# EAGLE design PFC_drivers_v1 (EAGLE 7.6.0)
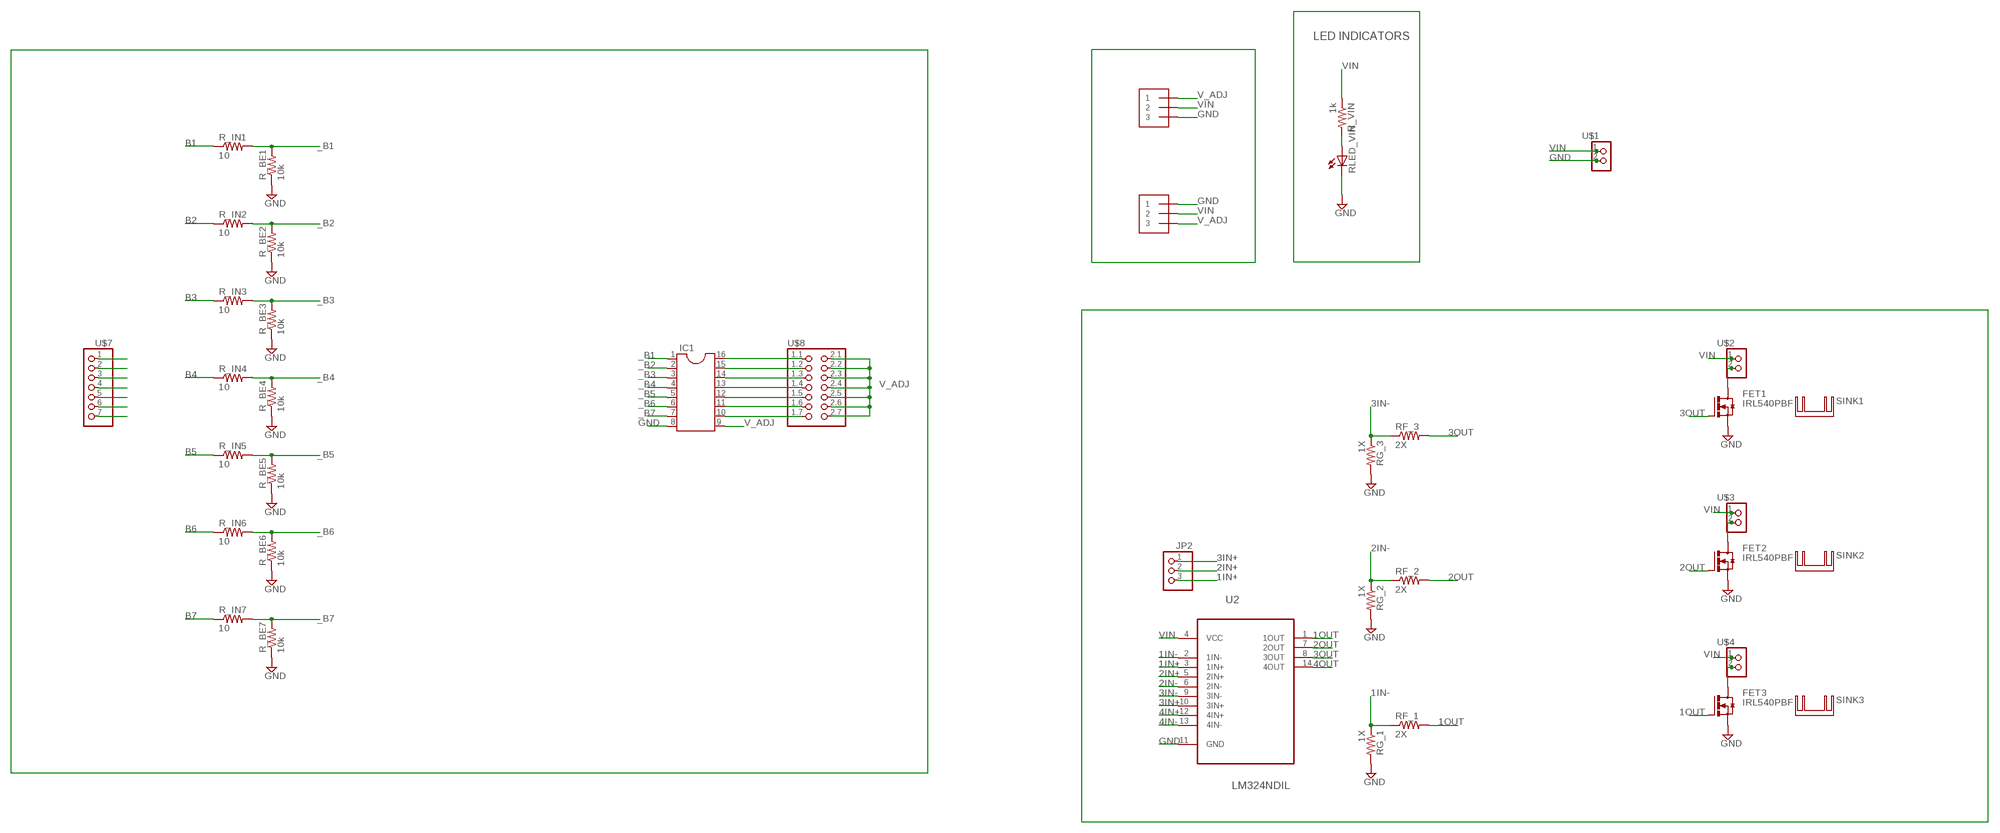
[diagram p0: schematic, sheet 1]

## Parts
FET1  IRL540PBF  [TO220AV]
FET2  IRL540PBF  [TO220AV]
FET3  IRL540PBF  [TO220AV]
IC1  DIL16S  [SOCKET-16]
JP2  PINHD-1X3  [1X03]
R_BE1  10k  R-US_R0603  [R0603]
R_BE2  10k  R-US_R0603  [R0603]
R_BE3  10k  R-US_R0603  [R0603]
R_BE4  10k  R-US_R0603  [R0603]
R_BE5  10k  R-US_R0603  [R0603]
R_BE6  10k  R-US_R0603  [R0603]
R_BE7  10k  R-US_R0603  [R0603]
R_IN1  10  R-US_R0603  [R0603]
R_IN2  10  R-US_R0603  [R0603]
R_IN3  10  R-US_R0603  [R0603]
R_IN4  10  R-US_R0603  [R0603]
R_IN5  10  R-US_R0603  [R0603]
R_IN6  10  R-US_R0603  [R0603]
R_IN7  10  R-US_R0603  [R0603]
R_VIN  1k  R-US_R0603  [R0603]
RF_1  2X  R-US_R0603  [R0603]
RF_2  2X  R-US_R0603  [R0603]
RF_3  2X  R-US_R0603  [R0603]
RG_1  1X  R-US_R0603  [R0603]
RG_2  1X  R-US_R0603  [R0603]
RG_3  1X  R-US_R0603  [R0603]
RLED_VIN  LEDCHIP-LED0603  [CHIP-LED0603]
SINK1  FW1S  [FW1S]
SINK2  FW1S  [FW1S]
SINK3  FW1S  [FW1S]
U2  LM324NDIL  [DIL14]
U$1  PINHD-2X1  [2X01]
U$2  PINHD-2X1  [2X01]
U$3  PINHD-2X1  [2X01]
U$4  PINHD-2X1  [2X01]
U$5  1X3  [1X3-3.5MM]
U$6  1X3  [1X3-3.5MM]
U$7  PINHD-1X7  [1X07]
U$8  PINHD-2X7  [2X07-BIG]

## Nets
1IN+: JP2.3 U2.3(1IN+)
1IN-: RF_1.1 RG_1.1 U2.2(1IN-)
1OUT: FET3.B(G) RF_1.2 U2.1(1OUT)
2IN+: JP2.2 U2.5(2IN+)
2IN-: RF_2.1 RG_2.1 U2.6(2IN-)
2OUT: FET2.B(G) RF_2.2 U2.7(2OUT)
3IN+: JP2.1 U2.10(3IN+)
3IN-: RF_3.1 RG_3.1 U2.9(3IN-)
3OUT: FET1.B(G) RF_3.2 U2.8(3OUT)
4IN+: U2.12(4IN+)
4IN-: U2.13(4IN-)
4OUT: U2.14(4OUT)
_B1: IC1.1 R_BE1.2 R_IN1.2
_B2: IC1.2 R_BE2.2 R_IN2.2
_B3: IC1.3 R_BE3.2 R_IN3.2
_B4: IC1.4 R_BE4.2 R_IN4.2
_B5: IC1.5 R_BE5.2 R_IN5.2
_B6: IC1.6 R_BE6.2 R_IN6.2
_B7: IC1.7 R_BE7.2 R_IN7.2
B1: R_IN1.1 U$7.1
B2: R_IN2.1 U$7.2
B3: R_IN3.1 U$7.3
B4: R_IN4.1 U$7.4
B5: R_IN5.1 U$7.5
B6: R_IN6.1 U$7.6
B7: R_IN7.1 U$7.7
GND: FET1.E(S) FET2.E(S) FET3.E(S) IC1.8 R_BE1.1 R_BE2.1 R_BE3.1 R_BE4.1 R_BE5.1 R_BE6.1 R_BE7.1 RG_1.2 RG_2.2 RG_3.2 RLED_VIN.C U2.11(GND) U$1.2 U$5.3 U$6.1
N$1: R_VIN.2 RLED_VIN.A
N$4: IC1.10 U$8.1.7
N$5: IC1.11 U$8.1.6
N$7: IC1.12 U$8.1.5
N$8: IC1.13 U$8.1.4
N$9: IC1.14 U$8.1.3
N$10: IC1.15 U$8.1.2
N$11: IC1.16 U$8.1.1
N$15: FET1.C(D) U$2.2
N$16: FET2.C(D) U$3.2
N$17: FET3.C(D) U$4.2
V_ADJ: IC1.9 U$5.1 U$6.3 U$8.2.1 U$8.2.2 U$8.2.3 U$8.2.4 U$8.2.5 U$8.2.6 U$8.2.7
VIN: R_VIN.1 U2.4(VCC) U$1.1 U$2.1 U$3.1 U$4.1 U$5.2 U$6.2

## Notes on the sheet
- LED INDICATORS

## Library data of the parts
FET1-FET3 = transistor-power:IRL540PBF
IC1 = ic-package:DIL16: Dual In Line / Socket
JP2 = adafruit:PINHD-1X3: PIN HEADER
R_BE1-R_BE7 R_IN1-R_IN7 R_VIN RF_1-RF_3 RG_1-RG_3 = resistor:R-US_: RESISTOR, American symbol
RLED_VIN = led:LED: LED OSRAM: - CHIPLED LG R971, LG N971, LY N971, LG Q971, LY Q971, LO R971, LY R971 LH N974, LH R974 LS Q976, LO Q976, LY Q976 LO Q996 - Hyper CHIPLED LW Q18S LB Q993, LB Q99A, LB R99A - SideLED LS A670, LO A670, LY A670, LG A670, LP A670 LB A673, LV A673, LT A673, LW A673 LH A674 LY A675 LS A676, LA A676, LO A676, LY A676, LW A676 LS A679, LY A679, LG A679 - Hyper Micro SIDELED® LS Y876, LA Y876, LO Y876, LY Y876 LT Y87S - SmartLED LW L88C, LW L88S LB L89C, LB L89S, LG L890 LS L89K, LO L89K, LY L89K LS L896, LA L896, LO L896, LY L896 - TOPLED LS T670, LO T670, LY T670, LG T670, LP T670 LSG T670, LSP T670, LSY T670, LOP T670, LYG T670 LG T671, LOG T671, LSG T671 LB T673, LV T673, LT T673, LW T673 LH T674 LS T676, LA T676, LO T676, LY T676, LB T676, LH T676, LSB T676, LW T676 LB T67C, LV T67C, LT T67C, LS T67K, LO T67K, LY T67K, LW E67C LS E67B, LA E67B, LO E67B, LY E67B, LB E67C, LV E67C, LT E67C LW T67C LS T679, LY T679, LG T679 LS T770, LO T770, LY T770, LG T770, LP T770 LB T773, LV T773, LT T773, LW T773 LH T774 LS E675, LA E675, LY E675, LS T675 LS T776, LA T776, LO T776, LY T776, LB T776 LHGB T686 LT T68C, LB T68C - Hyper Mini TOPLED® LB M676 - Mini TOPLED Santana® LG M470 LS M47K, LO M47K, LY M47K Source: http://www.osram.convergy.de LUXEON: - LUMILED® LXK2-PW12-R00, LXK2-PW12-S00, LXK2-PW14-U00, LXK2-PW14-V00 LXK2-PM12-R00, LXK2-PM12-S00, LXK2-PM14-U00 LXK2-PE12-Q00, LXK2-PE12-R00, LXK2-PE12-S00, LXK2-PE14-T00, LXK2-PE14-U00 LXK2-PB12-K00, LXK2-PB12-L00, LXK2-PB12-M00, LXK2-PB14-N00, LXK2-PB14-P00, LXK2-PB14-Q00 LXK2-PR12-L00, LXK2-PR12-M00, LXK2-PR14-Q00, LXK2-PR14-R00 LXK2-PD12-Q00, LXK2-PD12-R00, LXK2-PD12-S00 LXK2-PH12-R00, LXK2-PH12-S00 LXK2-PL12-P00, LXK2-PL12-Q00, LXK2-PL12-R00 Source: www.luxeon.com KINGBRIGHT: KA-3528ASYC Source: www.kingbright.com
SINK1-SINK3 = heatsink:FW1S
U2 = Texas Instruments_By_element14_Batch_1:LM324N: QUADRUPLE OPERATIONAL AMPLIFIERS
U$1-U$4 = pinhead:PINHD-2X1
U$5 U$6 = adafruit:1X3: 3.5mm Terminal Block
U$7 = adafruit:PINHD-1X7
U$8 = adafruit:PINHD-2X7

## Board
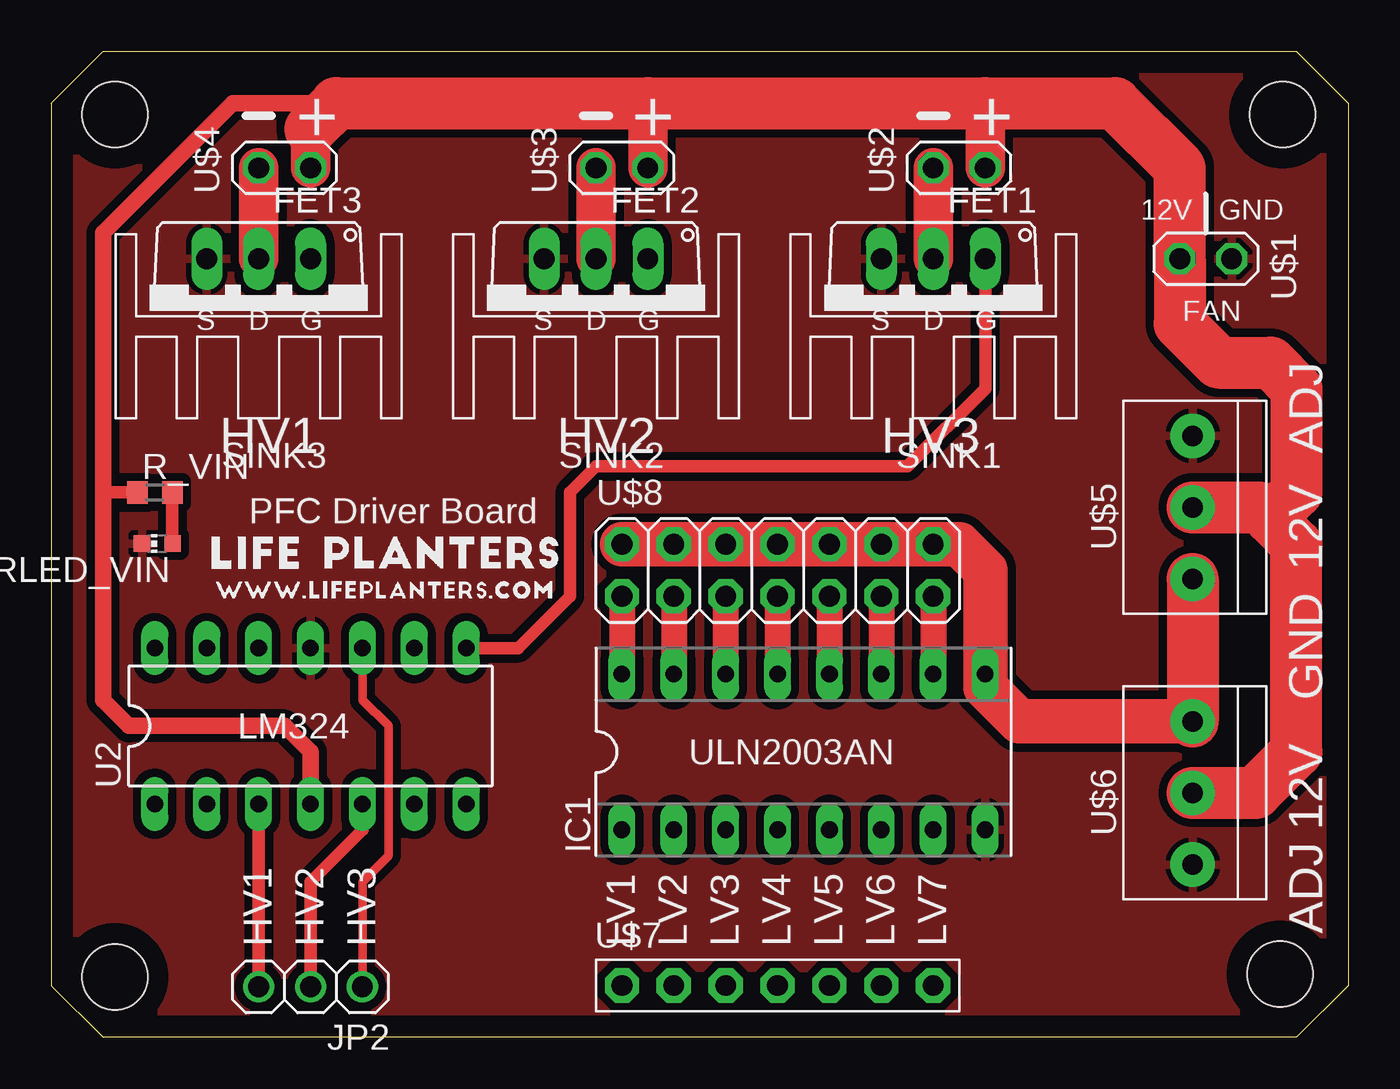
[diagram p1: board, top side]
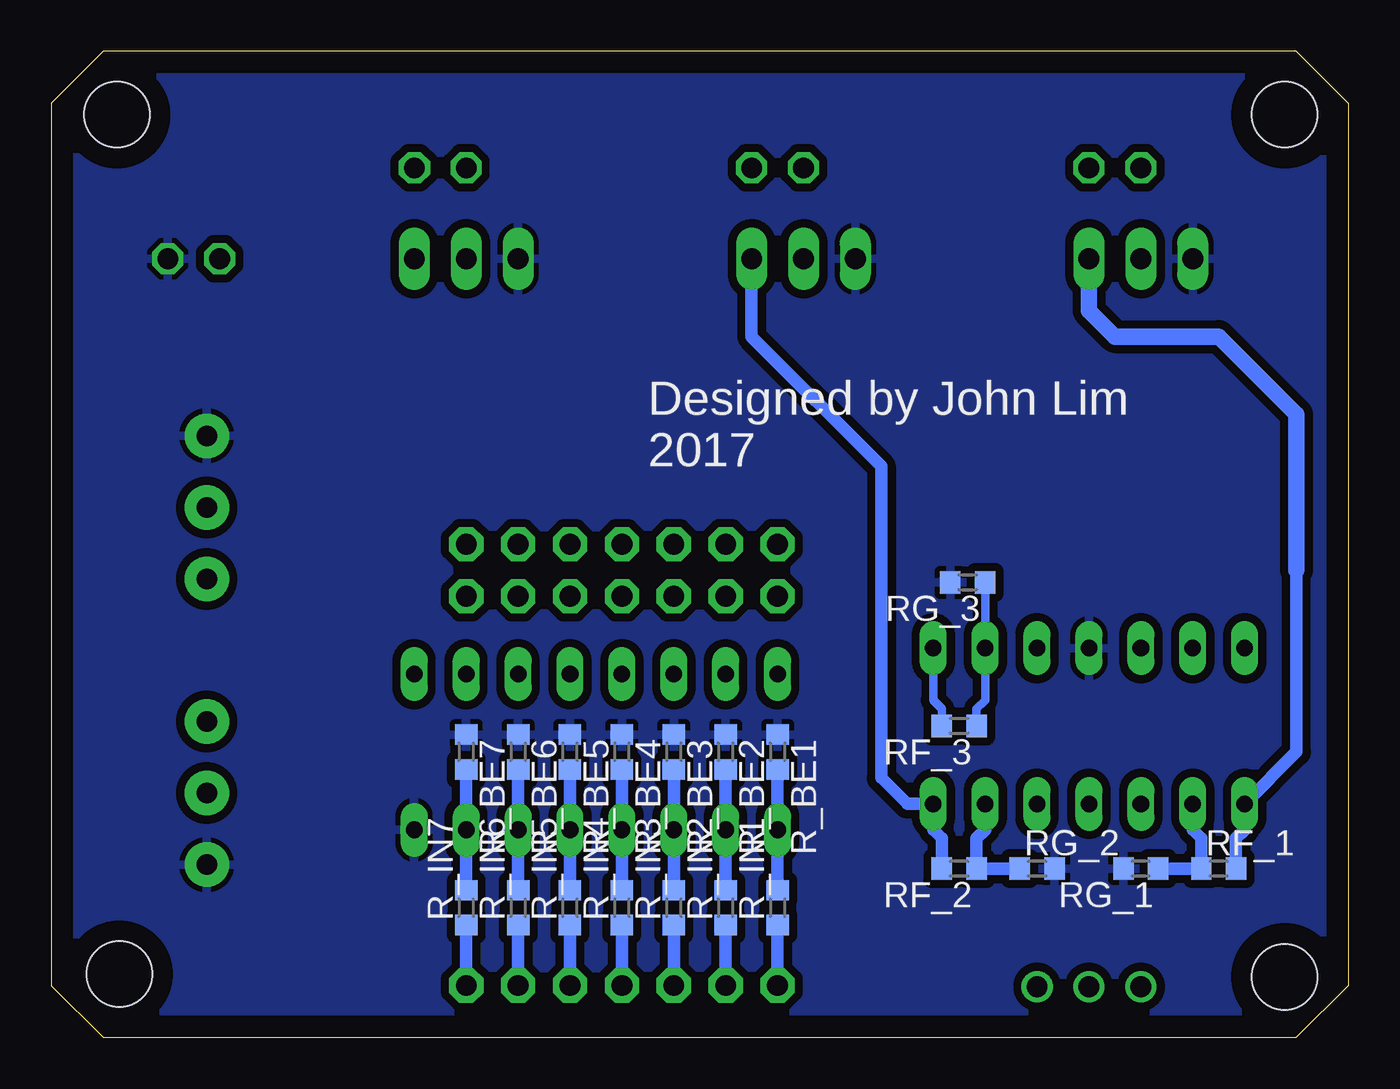
[diagram p2: board, bottom side, seen from below]

Size 63.5 x 48.26 mm. Coordinates in mm from the lower left corner, seen from the top.
Outline: 0,45.72 0,2.54 2.54,0 60.96,0 63.5,2.54 63.5,45.72 60.96,48.26 2.54,48.26 0,45.72
Copper layers (1*16): Top 0.035mm / dielectric 1.5mm / Bottom 0.035mm
Design rules "default": minimum track width 10mil, minimum drill 24mil, track to track 8mil, track to pad 8mil, pad to pad 8mil, via to via 8mil, smd to smd 8mil, copper to edge 40mil, drill to drill 8mil, minimum pad ring 10mil, minimum via ring 8mil, stop-mask expansion 4mil, vias tented up to drill 0mil, thermal gap 10mil
Holes 3.2 mm at 3.12,2.96 3.12,45.16 60.16,3.11 60.28,45.16

### Footprints (pad centres in the part's own frame; a part is rotated, then mirrored left to right if it is on the bottom)
TO220AV = drill 1.016 long: B -2.54,-2.54; C 0,-2.54; E 2.54,-2.54
SOCKET-16 = drill 0.813 long: 1 -8.89,-3.81; 2 -6.35,-3.81; 3 -3.81,-3.81; 4 -1.27,-3.81; 5 1.27,-3.81; 6 3.81,-3.81; 7 6.35,-3.81; 8 8.89,-3.81; 9 8.89,3.81; 10 6.35,3.81; 11 3.81,3.81; 12 1.27,3.81; 13 -1.27,3.81; 14 -3.81,3.81; 15 -6.35,3.81; 16 -8.89,3.81
1X03 = drill 1.016: 1 -2.54,0; 2 0,0; 3 2.54,0
R0603 = smd 1 x 1.1: 1 -0.85,0; 2 0.85,0
CHIP-LED0603 = smd 0.8 x 0.8: A 0,-0.75; C 0,0.75
DIL14 = drill 0.813 long: 1 0,-2.54; 2 2.54,-2.54; 3 5.08,-2.54; 4 7.62,-2.54; 5 10.16,-2.54; 6 12.7,-2.54; 7 15.24,-2.54; 8 15.24,5.08; 9 12.7,5.08; 10 10.16,5.08; 11 7.62,5.08; 12 5.08,5.08; 13 2.54,5.08; 14 0,5.08
2X01 = drill 1.016 octagon: 1 -1.27,-1.27; 2 -1.27,1.27
1X3-3.5MM = drill 1 pad 2.184: 1 2.11,3.81; 2 5.61,3.81; 3 9.11,3.81
1X07 = drill 1.016 pad 1.676 octagon: 1 -7.62,0; 2 -5.08,0; 3 -2.54,0; 4 0,0; 5 2.54,0; 6 5.08,0; 7 7.62,0
2X07-BIG = drill 1.016 pad 1.676 octagon: 1.1 -7.62,-1.27; 1.2 -5.08,-1.27; 1.3 -2.54,-1.27; 1.4 0,-1.27; 1.5 2.54,-1.27; 1.6 5.08,-1.27; 1.7 7.62,-1.27; 2.1 -7.62,1.27; 2.2 -5.08,1.27; 2.3 -2.54,1.27; 2.4 0,1.27; 2.5 2.54,1.27; 2.6 5.08,1.27; 2.7 7.62,1.27

### Placement (x,y rotation side)
FET1  43.18,35.56 180 top
FET2  26.67,35.56 180 top
FET3  10.16,35.56 180 top
IC1  36.83,13.97 0 top
JP2  12.7,2.48 180 top
R_BE1  27.94,13.97 270 bottom
R_BE2  30.48,13.97 270 bottom
R_BE3  33.02,13.97 270 bottom
R_BE4  35.56,13.97 270 bottom
R_BE5  38.1,13.97 270 bottom
R_BE6  40.64,13.97 270 bottom
R_BE7  43.18,13.97 270 bottom
R_IN1  27.94,6.35 90 bottom
R_IN2  30.48,6.35 90 bottom
R_IN3  33.02,6.35 90 bottom
R_IN4  35.56,6.35 90 bottom
R_IN5  38.1,6.35 90 bottom
R_IN6  40.64,6.35 90 bottom
R_IN7  43.18,6.35 90 bottom
R_VIN  5.08,26.67 0 top
RF_1  6.35,8.25 0 bottom
RF_2  19.05,8.25 180 bottom
RF_3  19.05,15.24 180 bottom
RG_1  10.16,8.25 180 bottom
RG_2  15.24,8.25 0 bottom
RG_3  18.64,22.26 180 bottom
RLED_VIN  5.2,24.16 90 top
SINK1  43.18,34.29 180 top
SINK2  26.67,34.29 180 top
SINK3  10.16,34.29 180 top
U2  5.08,13.97 0 top
U$1  56.52,36.83 270 top
U$2  44.45,43.81 90 top
U$3  27.94,43.81 90 top
U$4  11.43,43.81 90 top
U$5  59.69,20.32 90 top
U$6  59.69,6.35 90 top
U$7  35.56,2.54 0 top
U$8  35.56,22.86 0 top

### Tracks (layer width: path | path; a pad name or v marks a point on that pad's centre or on a via)
1IN+
  Top 0.61: U2.3 JP2.3
1IN-
  Bottom 0.61: U2.2 7.62,10.16 7.2,9.74 RF_1.1 RG_1.1
1OUT
  Bottom 0.61: 2.54,22.86 2.54,13.97 U2.1 5.08,10.16 5.5,9.74 RF_1.2
  Bottom 0.813: FET3.B 12.7,35.56 11.43,34.29 6.35,34.29 2.54,30.48 2.54,22.86
2IN+
  Top 0.61: U2.5 15.24,10.16 12.7,7.62 JP2.2
2IN-
  Bottom 0.61: U2.6 17.78,10.16 18.2,9.74 RF_2.1 RG_2.1
2OUT
  Bottom 0.61: FET2.B 29.21,34.29 22.86,27.94 22.86,12.7 21.59,11.43 U2.7 20.32,10.16 19.9,9.74 RF_2.2
3IN+
  Top 0.406: JP2.1 15.24,7.62 16.51,8.89 16.51,15.24 15.24,16.51 U2.10
3IN-
  Bottom 0.406: RF_3.1 18.2,16.09 17.78,16.51 U2.9 RG_3.1
3OUT
  Top 0.61: U2.8 22.86,19.05 25.4,21.59 25.4,26.67 26.67,27.94 41.91,27.94 45.72,31.75 FET1.B
  Bottom 0.406: U2.8 20.32,16.51 19.9,16.09 RF_3.2
_B1
  Bottom 0.61: R_BE1.2 IC1.1 R_IN1.2
_B2
  Bottom 0.61: R_BE2.2 IC1.2 R_IN2.2
_B3
  Bottom 0.61: R_BE3.2 IC1.3 R_IN3.2
_B4
  Bottom 0.61: R_BE4.2 IC1.4 R_IN4.2
_B5
  Bottom 0.61: R_BE5.2 IC1.5 R_IN5.2
_B6
  Bottom 0.61: R_BE6.2 IC1.6 R_IN6.2
_B7
  Bottom 0.61: R_BE7.2 IC1.7 R_IN7.2
B1
  Bottom 0.61: R_IN1.1 U$7.1
B2
  Bottom 0.61: R_IN2.1 U$7.2
B3
  Bottom 0.61: R_IN3.1 U$7.3
B4
  Bottom 0.61: R_IN4.1 U$7.4
B5
  Bottom 0.61: U$7.5 R_IN5.1
B6
  Bottom 0.61: R_IN6.1 U$7.6
B7
  Bottom 0.61: R_IN7.1 U$7.7
GND
  pour Bottom (isolate 0.406): 1.27,2.54 1.27,45.72 2.54,46.99 62.23,46.99 62.23,2.54 60.96,1.27 2.54,1.27
  pour Top (isolate 0.406): 1.27,45.72 2.54,46.99 62.23,46.99 62.23,2.54 60.96,1.27 2.54,1.27 1.27,2.54
N$1
  Top 0.61: R_VIN.2 5.93,24.18 RLED_VIN.A
N$4
  Top 1.27: U$8.1.7 IC1.10
N$5
  Top 1.27: U$8.1.6 IC1.11
N$7
  Top 1.27: U$8.1.5 IC1.12
N$8
  Top 1.27: U$8.1.4 IC1.13
N$9
  Top 1.27: U$8.1.3 IC1.14
N$10
  Top 1.27: U$8.1.2 IC1.15
N$11
  Top 1.27: U$8.1.1 IC1.16
N$15
  Top 1.93: U$2.2 FET1.C
N$16
  Top 1.93: U$3.2 FET2.C
N$17
  Top 1.93: U$4.2 FET3.C
V_ADJ
  Top 2.184: U$6.3 47.41,15.46 45.72,17.14 IC1.9 45.72,22.86 44.45,24.13 U$8.2.7 U$8.2.6 U$8.2.5 U$8.2.4 U$8.2.3 U$8.2.2 U$8.2.1
  Top 2.54: U$5.1 U$6.3
VIN
  Top 0.61: R_VIN.1 2.54,26.67
  Top 0.813: 13.97,45.72 8.89,45.72 2.54,39.37 2.54,26.67 2.54,16.51 3.81,15.24 11.43,15.24 12.7,13.97 U2.4
  Top 1.93: U$4.1 12.7,44.45 | U$3.1 29.21,45.72 | U$2.1 45.72,45.72
  Top 2.54: U$6.2 58.95,11.96 60.96,13.97 60.96,24.13 59.69,25.4 | 59.69,25.4 59.16,25.93 U$5.2 | 59.69,25.4 60.96,26.67 60.96,31.75 59.69,33.02 57.15,33.02 55.25,34.92 U$1.1 55.25,42.55 52.07,45.72 45.72,45.72 29.21,45.72 13.97,45.72 12.7,44.45

### Text on the board
tPlace: + | + | + | 12V | GND | FAN | S | D | G | S | D | G | S | D | G | HV1 | HV2 | HV3 | ADJ | PFC Driver Board | 12V | GND | LM324 | ULN2003AN | 12V | ADJ | HV1 | HV2 | HV3 | LV1 | LV2 | LV3 | LV4 | LV5 | LV6 | LV7
bPlace: Designed by John Lim / 2017